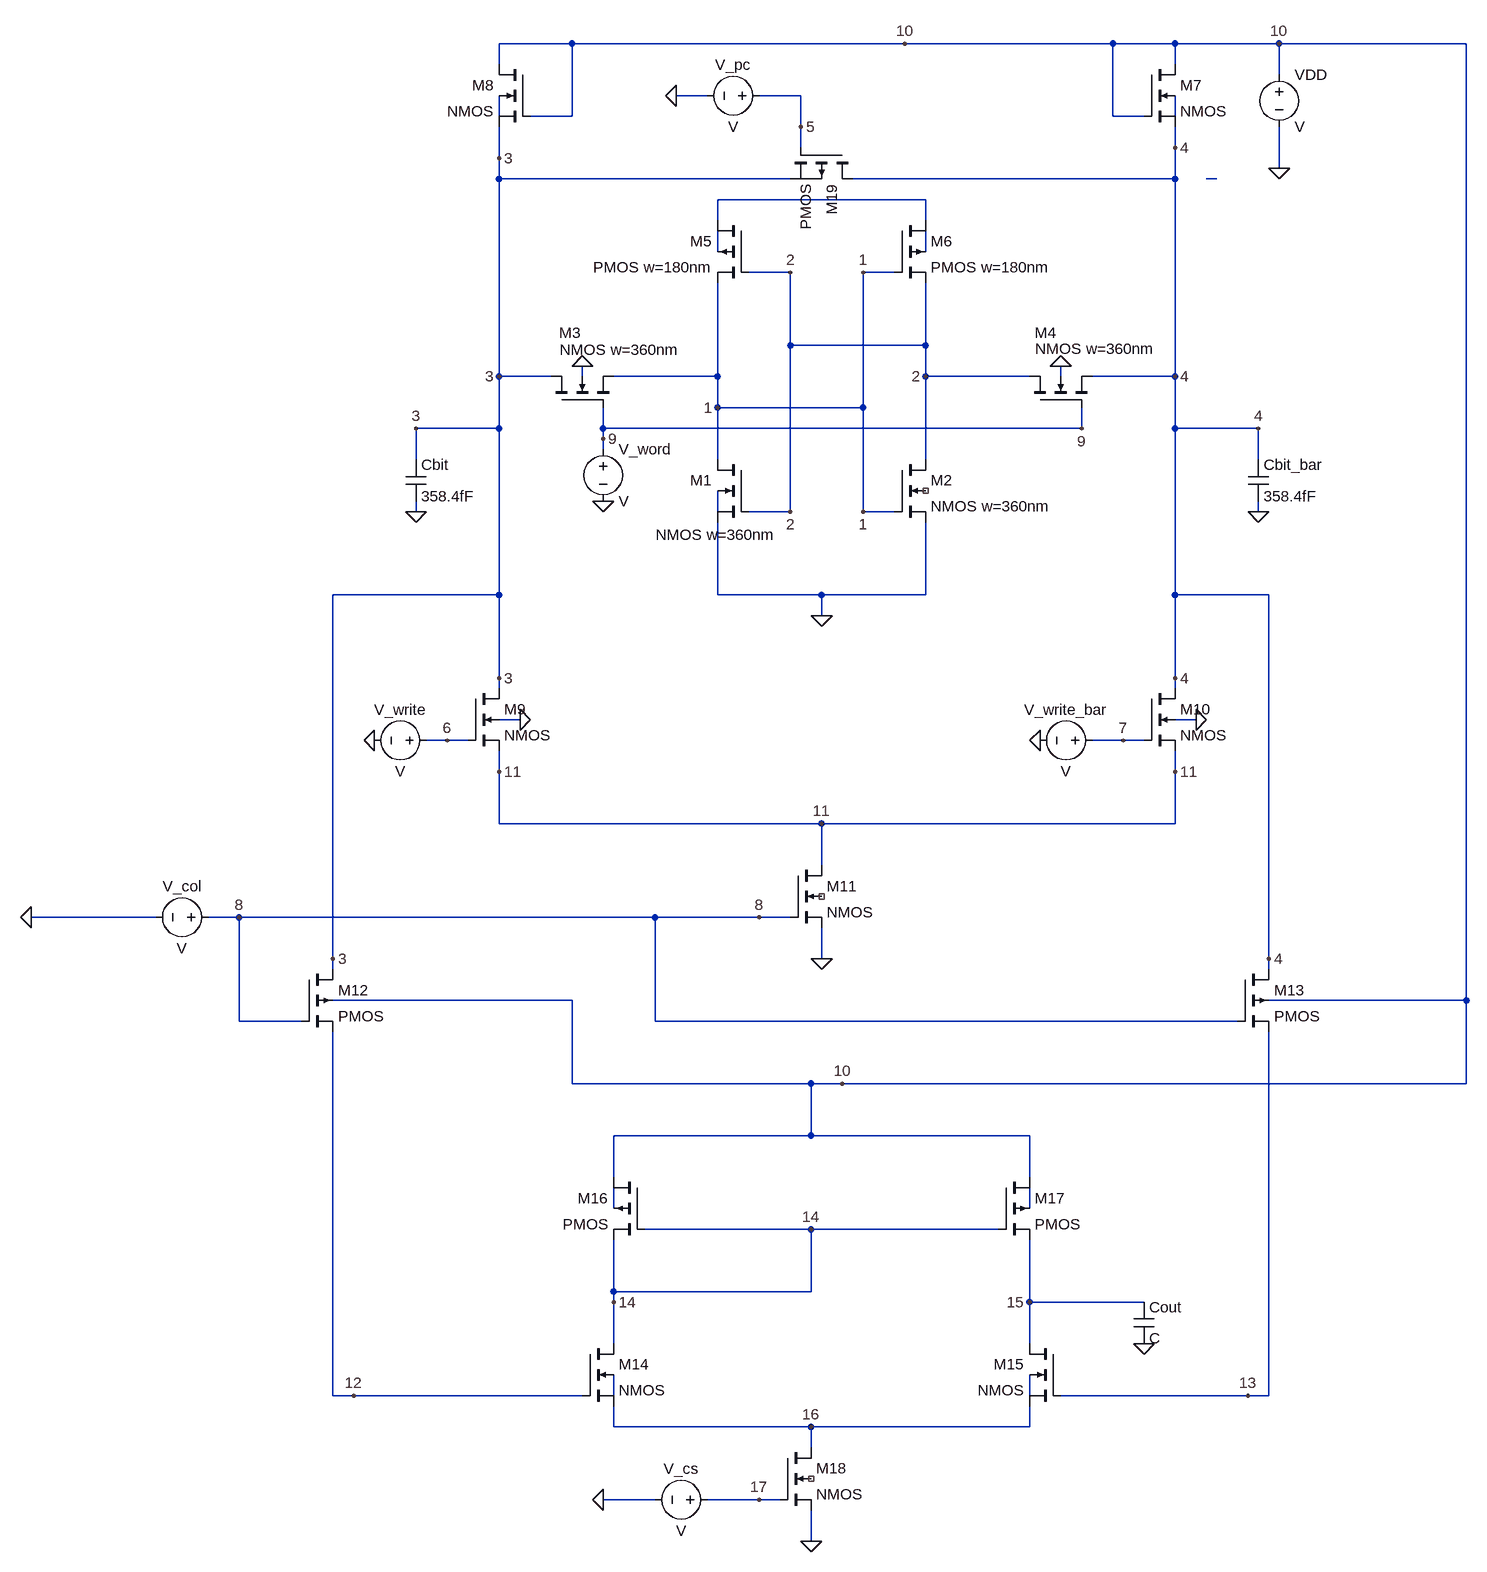
[diagram p0: schematic SRAM_write.asc]
SRAM_write.asc, the LTspice schematic file:
Version 4
SHEET 1 2372 2184
WIRE -16 -368 -128 -368
WIRE 496 -368 -16 -368
WIRE 816 -368 496 -368
WIRE 912 -368 816 -368
WIRE 1072 -368 912 -368
WIRE 1360 -368 1072 -368
WIRE -128 -336 -128 -368
WIRE 912 -336 912 -368
WIRE 1072 -320 1072 -368
WIRE 192 -288 144 -288
WIRE 336 -288 272 -288
WIRE -128 -256 -128 -288
WIRE -16 -256 -16 -368
WIRE -16 -256 -80 -256
WIRE 816 -256 816 -368
WIRE 864 -256 816 -256
WIRE 912 -256 912 -288
WIRE 336 -240 336 -288
WIRE 336 -208 336 -240
WIRE 912 -208 912 -240
WIRE -128 -192 -128 -240
WIRE 1072 -176 1072 -240
WIRE -128 -160 -128 -192
WIRE 320 -160 -128 -160
WIRE 912 -160 912 -208
WIRE 912 -160 416 -160
WIRE 976 -160 960 -160
WIRE 528 -128 208 -128
WIRE 208 -96 208 -128
WIRE 528 -96 528 -128
WIRE 208 -48 208 -80
WIRE 528 -48 528 -80
WIRE 320 -16 256 -16
WIRE 480 -16 432 -16
WIRE 320 96 320 -16
WIRE 528 96 528 0
WIRE 528 96 320 96
WIRE -128 144 -128 -160
WIRE -48 144 -128 144
WIRE 0 144 0 128
WIRE 208 144 208 0
WIRE 208 144 48 144
WIRE 528 144 528 96
WIRE 688 144 528 144
WIRE 736 144 736 128
WIRE 912 144 912 -160
WIRE 912 144 784 144
WIRE 208 192 208 144
WIRE 432 192 432 -16
WIRE 432 192 208 192
WIRE -128 224 -128 144
WIRE -128 224 -256 224
WIRE 32 224 32 192
WIRE 768 224 768 192
WIRE 768 224 32 224
WIRE 912 224 912 144
WIRE 1040 224 912 224
WIRE 32 240 32 224
WIRE 32 256 32 240
WIRE -256 272 -256 224
WIRE 208 272 208 192
WIRE 528 272 528 144
WIRE 1040 272 1040 224
WIRE -256 352 -256 336
WIRE 208 352 208 320
WIRE 320 352 320 96
WIRE 320 352 256 352
WIRE 432 352 432 192
WIRE 480 352 432 352
WIRE 1040 352 1040 336
WIRE -128 480 -128 224
WIRE -128 480 -384 480
WIRE 208 480 208 368
WIRE 368 480 208 480
WIRE 528 480 528 368
WIRE 528 480 368 480
WIRE 912 480 912 224
WIRE 1056 480 912 480
WIRE 368 512 368 480
WIRE -128 608 -128 480
WIRE 912 608 912 480
WIRE -128 624 -128 608
WIRE 912 624 912 608
WIRE -96 672 -128 672
WIRE 944 672 912 672
WIRE -208 704 -240 704
WIRE -176 704 -208 704
WIRE 832 704 784 704
WIRE 864 704 832 704
WIRE -128 752 -128 720
WIRE 912 752 912 720
WIRE -128 832 -128 752
WIRE 368 832 -128 832
WIRE 912 832 912 752
WIRE 912 832 368 832
WIRE 368 896 368 832
WIRE -656 976 -848 976
WIRE -528 976 -576 976
WIRE 112 976 -528 976
WIRE 272 976 112 976
WIRE 320 976 272 976
WIRE -384 1040 -384 480
WIRE 368 1040 368 992
WIRE 1056 1040 1056 480
WIRE -384 1056 -384 1040
WIRE 1056 1056 1056 1040
WIRE -16 1104 -384 1104
WIRE 1360 1104 1360 -368
WIRE 1360 1104 1056 1104
WIRE -528 1136 -528 976
WIRE -432 1136 -528 1136
WIRE 112 1136 112 976
WIRE 1008 1136 112 1136
WIRE -16 1232 -16 1104
WIRE 352 1232 -16 1232
WIRE 400 1232 352 1232
WIRE 1360 1232 1360 1104
WIRE 1360 1232 400 1232
WIRE 352 1312 352 1232
WIRE 352 1312 48 1312
WIRE 688 1312 352 1312
WIRE 48 1376 48 1312
WIRE 688 1376 688 1312
WIRE 48 1424 48 1392
WIRE 688 1424 688 1392
WIRE 352 1456 96 1456
WIRE 640 1456 352 1456
WIRE 48 1552 48 1472
WIRE 352 1552 352 1456
WIRE 352 1552 48 1552
WIRE 48 1568 48 1552
WIRE 688 1568 688 1472
WIRE 864 1568 688 1568
WIRE 48 1632 48 1568
WIRE 688 1632 688 1568
WIRE -384 1712 -384 1152
WIRE -352 1712 -384 1712
WIRE 0 1712 -352 1712
WIRE 48 1712 48 1680
WIRE 688 1712 688 1680
WIRE 1024 1712 736 1712
WIRE 1056 1712 1056 1152
WIRE 1056 1712 1024 1712
WIRE 48 1760 48 1728
WIRE 352 1760 48 1760
WIRE 688 1760 688 1728
WIRE 688 1760 352 1760
WIRE 352 1792 352 1760
WIRE 112 1872 32 1872
WIRE 272 1872 192 1872
WIRE 304 1872 272 1872
WIRE 352 1936 352 1888
FLAG -256 352 0
FLAG 1040 352 0
FLAG 736 128 0
FLAG 0 128 0
FLAG -96 672 0
FLAG 944 672 0
FLAG 368 1040 0
FLAG 368 512 0
FLAG 1072 -176 0
FLAG 32 336 0
FLAG 704 704 0
FLAG -320 704 0
FLAG 208 192 1
FLAG 528 144 2
FLAG -848 976 0
FLAG -128 144 3
FLAG 912 144 4
FLAG 432 -16 1
FLAG 432 352 1
FLAG 320 -16 2
FLAG 320 352 2
FLAG -256 224 3
FLAG 1040 224 4
FLAG -208 704 6
FLAG 832 704 7
FLAG 272 976 8
FLAG 32 240 9
FLAG 768 224 9
FLAG 1072 -368 10
FLAG 368 832 11
FLAG -128 752 11
FLAG 912 752 11
FLAG 352 1936 0
FLAG 32 1872 0
FLAG 864 1632 0
FLAG -384 1040 3
FLAG -128 608 3
FLAG 1056 1040 4
FLAG 912 608 4
FLAG -352 1712 12
FLAG -528 976 8
FLAG 1024 1712 13
FLAG 400 1232 10
FLAG 48 1568 14
FLAG 352 1456 14
FLAG 688 1568 15
FLAG 352 1760 16
FLAG 272 1872 17
FLAG 144 -288 0
FLAG 336 -240 5
FLAG 496 -368 10
FLAG 912 -208 4
FLAG -128 -192 3
SYMBOL nmos4 256 272 M0
WINDOW 3 51 100 Top 2
SYMATTR Value NMOS w=360nm
SYMATTR InstName M1
SYMBOL nmos4 480 272 R0
SYMATTR InstName M2
SYMATTR Value NMOS w=360nm
SYMBOL nmos4 -48 192 R270
WINDOW 0 115 12 VRight 2
WINDOW 3 89 13 VRight 2
SYMATTR InstName M3
SYMATTR Value NMOS w=360nm
SYMBOL nmos4 688 192 R270
WINDOW 0 115 8 VRight 2
WINDOW 3 91 9 VRight 2
SYMATTR InstName M4
SYMATTR Value NMOS w=360nm
SYMBOL nmos4 -176 624 R0
SYMATTR InstName M9
SYMBOL nmos4 320 896 R0
SYMATTR InstName M11
SYMBOL nmos4 864 624 R0
SYMATTR InstName M10
SYMBOL pmos4 256 -96 M0
SYMATTR InstName M5
SYMATTR Value PMOS w=180nm
SYMBOL pmos4 480 -96 R0
SYMATTR InstName M6
SYMATTR Value PMOS w=180nm
SYMBOL cap -272 272 R0
SYMATTR InstName Cbit
SYMATTR Value 358.4fF
SYMBOL cap 1024 272 R0
SYMATTR InstName Cbit_bar
SYMATTR Value 358.4fF
SYMBOL voltage 1072 -336 R0
SYMATTR InstName VDD
SYMBOL voltage 800 704 R90
WINDOW 0 -32 56 VBottom 2
WINDOW 3 32 56 VTop 2
SYMATTR InstName V_write_bar
SYMBOL voltage -224 704 R90
WINDOW 0 -32 56 VBottom 2
WINDOW 3 32 56 VTop 2
SYMATTR InstName V_write
SYMBOL voltage 32 240 R0
SYMATTR InstName V_word
SYMBOL voltage 288 -288 R90
WINDOW 0 -32 56 VBottom 2
WINDOW 3 32 56 VTop 2
SYMATTR InstName V_pc
SYMBOL voltage -560 976 R90
WINDOW 0 -32 56 VBottom 2
WINDOW 3 32 56 VTop 2
SYMATTR InstName V_col
SYMBOL pmos4 -432 1056 R0
SYMATTR InstName M12
SYMBOL pmos4 1008 1056 R0
SYMATTR InstName M13
SYMBOL pmos4 640 1376 R0
SYMATTR InstName M17
SYMBOL pmos4 96 1376 M0
SYMATTR InstName M16
SYMBOL nmos4 0 1632 R0
SYMATTR InstName M14
SYMBOL nmos4 304 1792 R0
SYMATTR InstName M18
SYMBOL nmos4 736 1632 M0
SYMATTR InstName M15
SYMBOL voltage 208 1872 R90
WINDOW 0 -32 56 VBottom 2
WINDOW 3 32 56 VTop 2
SYMATTR InstName V_cs
SYMBOL cap 848 1568 R0
SYMATTR InstName Cout
SYMBOL nmos4 864 -336 R0
SYMATTR InstName M7
SYMBOL nmos4 -80 -336 M0
SYMATTR InstName M8
SYMBOL pmos 416 -208 R90
SYMATTR InstName M19

The netlist it stands for:
* SRAM_write.asc
M1 1 2 0 N007 NMOS w=360nm
M2 2 1 0 NC_01 NMOS w=360nm
M3 3 9 1 0 NMOS w=360nm
M4 2 9 4 0 NMOS w=360nm
M9 3 6 11 0 NMOS
M11 11 8 0 NC_02 NMOS
M10 4 7 11 0 NMOS
M5 N004 2 1 N005 PMOS w=180nm
M6 N004 1 2 N006 PMOS w=180nm
Cbit 3 0 358.4fF
Cbit_bar 4 0 358.4fF
VDD 10 0 V
V_write_bar 7 0 V
V_write 6 0 V
V_word 9 0 V
V_pc 5 0 V
V_col 8 0 V
M12 3 8 12 10 PMOS
M13 4 8 13 10 PMOS
M17 10 14 15 N009 PMOS
M16 10 14 14 N008 PMOS
M14 14 12 16 N010 NMOS
M18 16 17 0 NC_03 NMOS
M15 15 13 16 N011 NMOS
V_cs 17 0 V
Cout 15 0 C
M7 10 10 4 N002 NMOS
M8 10 10 3 N001 NMOS
M19 4 5 3 3 PMOS
.model NMOS NMOS
.model PMOS PMOS
.lib standard.mos
.backanno
.end